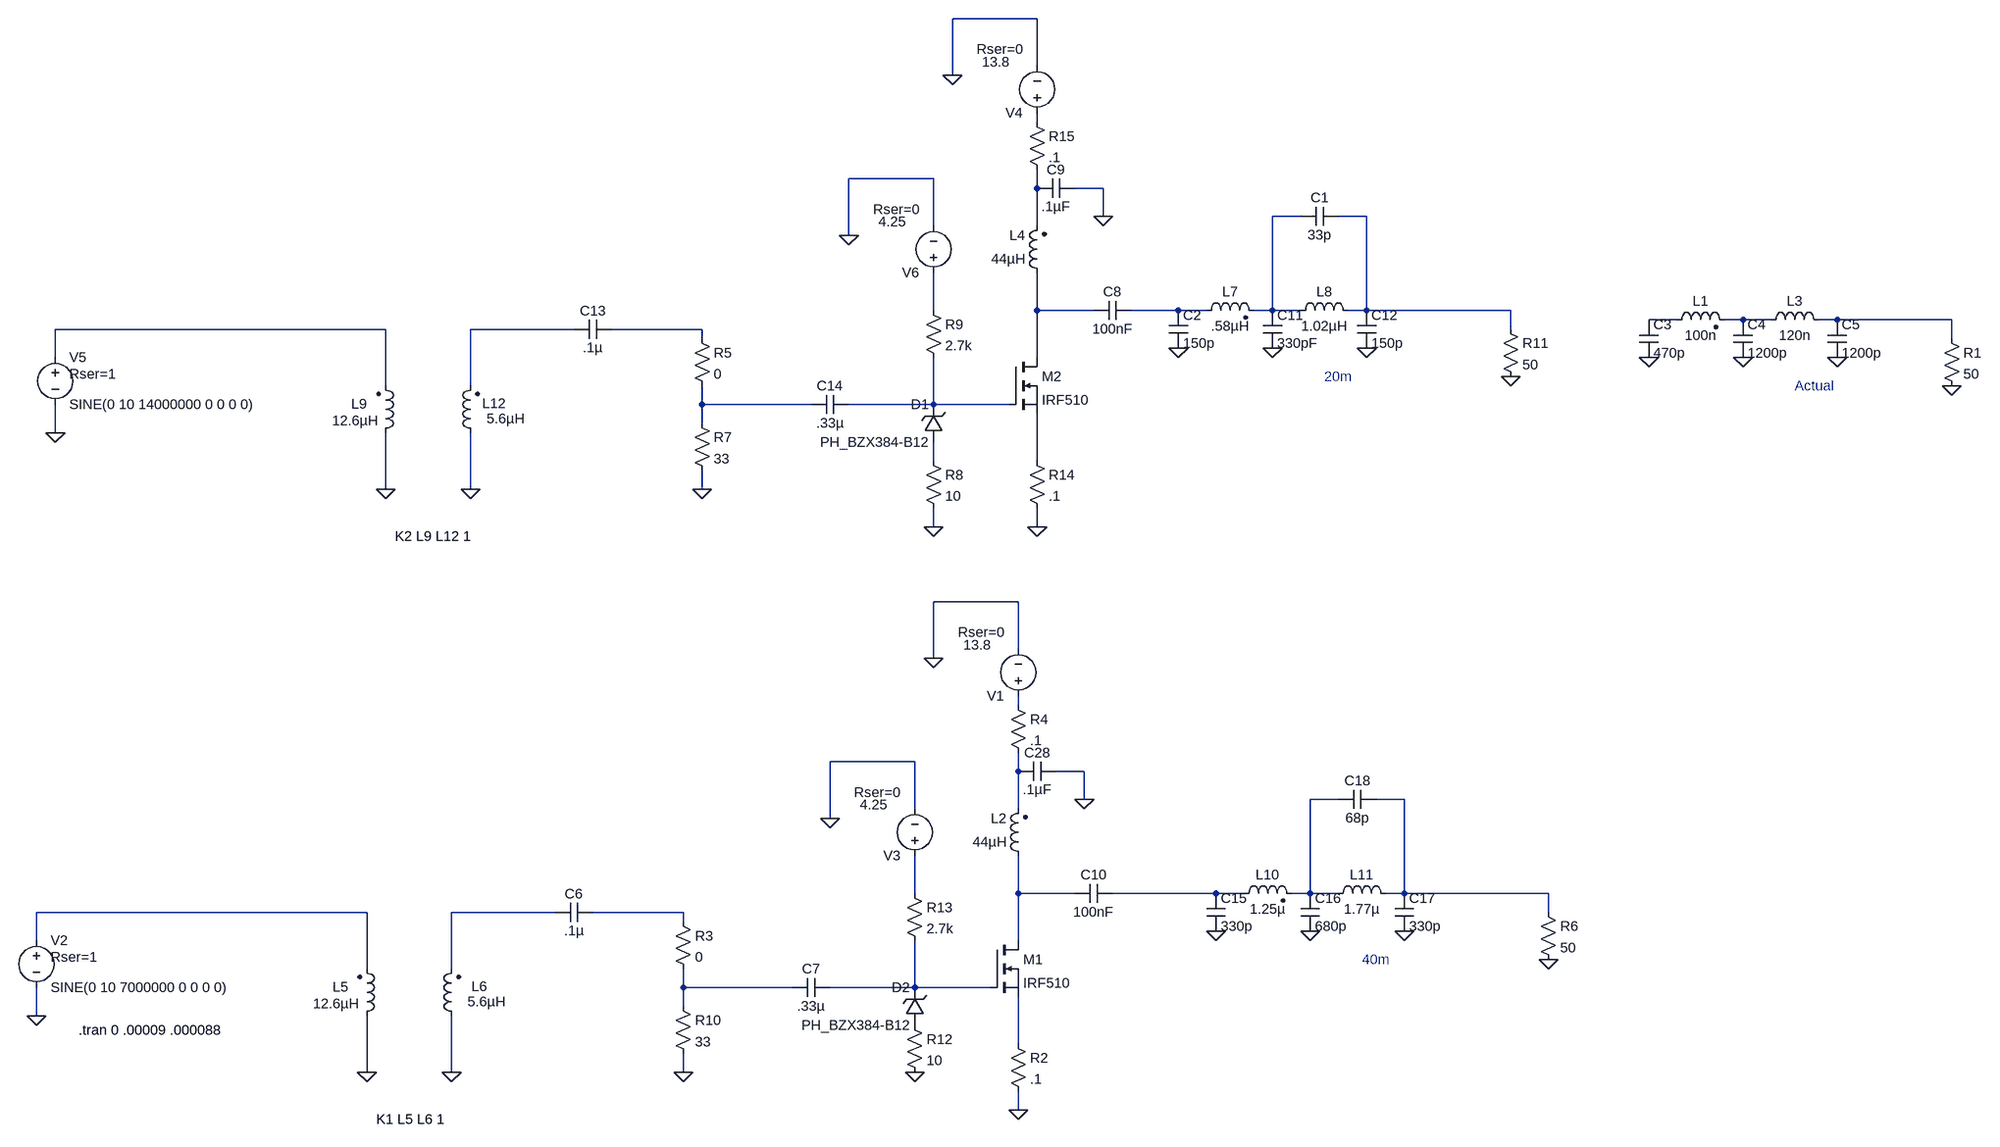
[diagram p0: schematic 10W IRF510 Amp.asc]
10W IRF510 Amp.asc, the LTspice schematic file:
Version 4
SHEET 1 3764 1240
WIRE 240 -1904 96 -1904
WIRE 240 -1824 240 -1904
WIRE 96 -1808 96 -1904
WIRE 240 -1728 240 -1744
WIRE 64 -1632 -80 -1632
WIRE 240 -1616 240 -1648
WIRE 352 -1616 304 -1616
WIRE 352 -1568 352 -1616
WIRE 688 -1568 640 -1568
WIRE 800 -1568 752 -1568
WIRE 64 -1552 64 -1632
WIRE 240 -1552 240 -1616
WIRE -80 -1536 -80 -1632
WIRE 64 -1408 64 -1472
WIRE 240 -1408 240 -1472
WIRE 336 -1408 240 -1408
WIRE 480 -1408 400 -1408
WIRE 528 -1408 480 -1408
WIRE 640 -1408 640 -1568
WIRE 640 -1408 608 -1408
WIRE 688 -1408 640 -1408
WIRE 800 -1408 800 -1568
WIRE 800 -1408 768 -1408
WIRE 1168 -1408 800 -1408
WIRE 1584 -1392 1536 -1392
WIRE 1696 -1392 1664 -1392
WIRE 1744 -1392 1696 -1392
WIRE 1856 -1392 1824 -1392
WIRE 2224 -1392 1856 -1392
WIRE -912 -1376 -1600 -1376
WIRE -592 -1376 -768 -1376
WIRE -336 -1376 -528 -1376
WIRE 1168 -1376 1168 -1408
WIRE -336 -1360 -336 -1376
WIRE 2224 -1360 2224 -1392
WIRE -1600 -1328 -1600 -1376
WIRE 240 -1328 240 -1408
WIRE -912 -1280 -912 -1376
WIRE -768 -1280 -768 -1376
WIRE -336 -1248 -336 -1280
WIRE -144 -1248 -336 -1248
WIRE 64 -1248 64 -1328
WIRE 64 -1248 -80 -1248
WIRE 192 -1248 64 -1248
WIRE -336 -1216 -336 -1248
WIRE -1600 -1200 -1600 -1248
WIRE 64 -1152 64 -1184
WIRE 240 -1152 240 -1232
WIRE -912 -1104 -912 -1200
WIRE -768 -1104 -768 -1200
WIRE -336 -1104 -336 -1136
WIRE 64 -1040 64 -1072
WIRE 240 -1040 240 -1072
WIRE 208 -704 64 -704
WIRE 208 -624 208 -704
WIRE 64 -608 64 -704
WIRE 208 -528 208 -544
WIRE 32 -432 -112 -432
WIRE 208 -416 208 -448
WIRE 320 -416 272 -416
WIRE 320 -368 320 -416
WIRE 752 -368 704 -368
WIRE 864 -368 816 -368
WIRE 32 -352 32 -432
WIRE 208 -352 208 -416
WIRE -112 -336 -112 -432
WIRE 32 -208 32 -272
WIRE 208 -208 208 -272
WIRE 304 -208 208 -208
WIRE 544 -208 368 -208
WIRE 592 -208 544 -208
WIRE 704 -208 704 -368
WIRE 704 -208 672 -208
WIRE 752 -208 704 -208
WIRE 864 -208 864 -368
WIRE 864 -208 832 -208
WIRE 1232 -208 864 -208
WIRE -944 -176 -1632 -176
WIRE -624 -176 -800 -176
WIRE -368 -176 -560 -176
WIRE 1232 -176 1232 -208
WIRE -368 -160 -368 -176
WIRE -1632 -128 -1632 -176
WIRE 208 -128 208 -208
WIRE -944 -80 -944 -176
WIRE -800 -80 -800 -176
WIRE -368 -48 -368 -80
WIRE -176 -48 -368 -48
WIRE 32 -48 32 -128
WIRE 32 -48 -112 -48
WIRE 160 -48 32 -48
WIRE -368 -16 -368 -48
WIRE -1632 0 -1632 -48
WIRE 208 48 208 -32
WIRE -944 96 -944 0
WIRE -800 96 -800 0
WIRE -368 96 -368 64
WIRE 208 160 208 128
FLAG 64 -608 0
FLAG 1168 -1296 0
FLAG 480 -1344 0
FLAG 640 -1344 0
FLAG 800 -1344 0
FLAG -1632 0 0
FLAG 320 -368 0
FLAG -944 96 0
FLAG -800 96 0
FLAG -368 96 0
FLAG 32 96 0
FLAG 208 160 0
FLAG -112 -336 0
FLAG 2224 -1280 0
FLAG 1536 -1328 0
FLAG 1696 -1328 0
FLAG 1856 -1328 0
FLAG 1232 -96 0
FLAG 544 -144 0
FLAG 704 -144 0
FLAG 864 -144 0
FLAG 96 -1808 0
FLAG -1600 -1200 0
FLAG 352 -1568 0
FLAG -912 -1104 0
FLAG -768 -1104 0
FLAG -336 -1104 0
FLAG 64 -1040 0
FLAG 240 -1040 0
FLAG -80 -1536 0
SYMBOL voltage 208 -528 R180
WINDOW 123 0 0 Left 0
WINDOW 39 24 124 Left 2
WINDOW 3 46 103 Left 2
SYMATTR SpiceLine Rser=0
SYMATTR Value 13.8
SYMATTR InstName V1
SYMBOL ind2 224 -256 R180
WINDOW 0 36 80 Left 2
WINDOW 3 36 40 Left 2
SYMATTR InstName L2
SYMATTR Value 44µH
SYMATTR Type ind
SYMBOL cap 368 -224 R90
WINDOW 0 0 32 VBottom 2
WINDOW 3 32 32 VTop 2
SYMATTR InstName C10
SYMATTR Value 100nF
SYMBOL ind2 -960 16 M180
WINDOW 0 -42 65 Left 2
WINDOW 3 -75 37 Left 2
SYMATTR InstName L5
SYMATTR Value 12.6µH
SYMATTR Type ind
SYMBOL ind2 -784 16 R180
WINDOW 0 -45 66 Left 2
WINDOW 3 -76 40 Left 2
SYMATTR InstName L6
SYMATTR Value 5.6µH
SYMATTR Type ind
SYMBOL res 1152 -1392 R0
SYMATTR InstName R11
SYMATTR Value 50
SYMBOL cap 464 -1408 R0
SYMATTR InstName C2
SYMATTR Value 150p
SYMBOL cap 624 -1408 R0
SYMATTR InstName C11
SYMATTR Value 330pF
SYMBOL cap 784 -1408 R0
SYMATTR InstName C12
SYMATTR Value 150p
SYMBOL ind2 512 -1392 R270
WINDOW 0 32 56 VTop 2
WINDOW 3 5 56 VBottom 2
SYMATTR InstName L7
SYMATTR Value .58µH
SYMATTR Type ind
SYMBOL ind 672 -1392 R270
WINDOW 0 32 56 VTop 2
WINDOW 3 5 56 VBottom 2
SYMATTR InstName L8
SYMATTR Value 1.02µH
SYMBOL voltage -1632 -144 R0
WINDOW 123 0 0 Left 0
WINDOW 39 24 44 Left 2
SYMATTR SpiceLine Rser=1
SYMATTR InstName V2
SYMATTR Value SINE(0 10 7000000 0 0 0 0)
SYMBOL cap 272 -432 R90
WINDOW 0 0 32 VBottom 2
WINDOW 3 32 32 VTop 2
SYMATTR InstName C28
SYMATTR Value .1µF
SYMBOL cap -560 -192 R90
WINDOW 0 0 32 VBottom 2
WINDOW 3 32 32 VTop 2
SYMATTR InstName C6
SYMATTR Value .1µ
SYMBOL zener 48 16 R180
WINDOW 0 24 64 Left 2
WINDOW 3 24 0 Left 2
SYMATTR InstName D2
SYMATTR Value PH_BZX384-B12
SYMBOL res -384 -176 R0
SYMATTR InstName R3
SYMATTR Value 0
SYMBOL res -384 -32 R0
SYMATTR InstName R10
SYMATTR Value 33
SYMBOL cap -112 -64 R90
WINDOW 0 0 32 VBottom 2
WINDOW 3 32 32 VTop 2
SYMATTR InstName C7
SYMATTR Value .33µ
SYMBOL res 16 0 R0
SYMATTR InstName R12
SYMATTR Value 10
SYMBOL nmos 160 -128 R0
SYMATTR InstName M1
SYMATTR Value IRF510
SYMBOL res 16 -224 R0
SYMATTR InstName R13
SYMATTR Value 2.7k
SYMBOL voltage 32 -256 R180
WINDOW 123 0 0 Left 0
WINDOW 39 24 124 Left 2
WINDOW 3 46 103 Left 2
SYMATTR SpiceLine Rser=0
SYMATTR Value 4.25
SYMATTR InstName V3
SYMBOL cap 752 -1584 R90
WINDOW 0 0 32 VBottom 2
WINDOW 3 32 32 VTop 2
SYMATTR InstName C1
SYMATTR Value 33p
SYMBOL res 2208 -1376 R0
SYMATTR InstName R1
SYMATTR Value 50
SYMBOL cap 1520 -1392 R0
SYMATTR InstName C3
SYMATTR Value 470p
SYMBOL cap 1680 -1392 R0
SYMATTR InstName C4
SYMATTR Value 1200p
SYMBOL cap 1840 -1392 R0
SYMATTR InstName C5
SYMATTR Value 1200p
SYMBOL ind2 1568 -1376 R270
WINDOW 0 32 56 VTop 2
WINDOW 3 5 56 VBottom 2
SYMATTR InstName L1
SYMATTR Value 100n
SYMATTR Type ind
SYMBOL ind 1728 -1376 R270
WINDOW 0 32 56 VTop 2
WINDOW 3 5 56 VBottom 2
SYMATTR InstName L3
SYMATTR Value 120n
SYMBOL res 192 32 R0
SYMATTR InstName R2
SYMATTR Value .1
SYMBOL res 192 -544 R0
SYMATTR InstName R4
SYMATTR Value .1
SYMBOL res 1216 -192 R0
SYMATTR InstName R6
SYMATTR Value 50
SYMBOL cap 528 -208 R0
SYMATTR InstName C15
SYMATTR Value 330p
SYMBOL cap 688 -208 R0
SYMATTR InstName C16
SYMATTR Value 680p
SYMBOL cap 848 -208 R0
SYMATTR InstName C17
SYMATTR Value 330p
SYMBOL ind2 576 -192 R270
WINDOW 0 32 56 VTop 2
WINDOW 3 5 56 VBottom 2
SYMATTR InstName L10
SYMATTR Value 1.25µ
SYMATTR Type ind
SYMBOL ind 736 -192 R270
WINDOW 0 32 56 VTop 2
WINDOW 3 5 56 VBottom 2
SYMATTR InstName L11
SYMATTR Value 1.77µ
SYMBOL cap 816 -384 R90
WINDOW 0 0 32 VBottom 2
WINDOW 3 32 32 VTop 2
SYMATTR InstName C18
SYMATTR Value 68p
SYMBOL voltage 240 -1728 R180
WINDOW 123 0 0 Left 0
WINDOW 39 24 124 Left 2
WINDOW 3 46 103 Left 2
SYMATTR SpiceLine Rser=0
SYMATTR Value 13.8
SYMATTR InstName V4
SYMBOL ind2 256 -1456 R180
WINDOW 0 36 80 Left 2
WINDOW 3 36 40 Left 2
SYMATTR InstName L4
SYMATTR Value 44µH
SYMATTR Type ind
SYMBOL cap 400 -1424 R90
WINDOW 0 0 32 VBottom 2
WINDOW 3 32 32 VTop 2
SYMATTR InstName C8
SYMATTR Value 100nF
SYMBOL ind2 -928 -1184 M180
WINDOW 0 -42 65 Left 2
WINDOW 3 -75 37 Left 2
SYMATTR InstName L9
SYMATTR Value 12.6µH
SYMATTR Type ind
SYMBOL ind2 -752 -1184 R180
WINDOW 0 -45 66 Left 2
WINDOW 3 -76 40 Left 2
SYMATTR InstName L12
SYMATTR Value 5.6µH
SYMATTR Type ind
SYMBOL voltage -1600 -1344 R0
WINDOW 123 0 0 Left 0
WINDOW 39 24 44 Left 2
SYMATTR SpiceLine Rser=1
SYMATTR InstName V5
SYMATTR Value SINE(0 10 14000000 0 0 0 0)
SYMBOL cap 304 -1632 R90
WINDOW 0 0 32 VBottom 2
WINDOW 3 32 32 VTop 2
SYMATTR InstName C9
SYMATTR Value .1µF
SYMBOL cap -528 -1392 R90
WINDOW 0 0 32 VBottom 2
WINDOW 3 32 32 VTop 2
SYMATTR InstName C13
SYMATTR Value .1µ
SYMBOL zener 80 -1184 R180
WINDOW 0 24 64 Left 2
WINDOW 3 24 0 Left 2
SYMATTR InstName D1
SYMATTR Value PH_BZX384-B12
SYMBOL res -352 -1376 R0
SYMATTR InstName R5
SYMATTR Value 0
SYMBOL res -352 -1232 R0
SYMATTR InstName R7
SYMATTR Value 33
SYMBOL cap -80 -1264 R90
WINDOW 0 0 32 VBottom 2
WINDOW 3 32 32 VTop 2
SYMATTR InstName C14
SYMATTR Value .33µ
SYMBOL res 48 -1168 R0
SYMATTR InstName R8
SYMATTR Value 10
SYMBOL nmos 192 -1328 R0
SYMATTR InstName M2
SYMATTR Value IRF510
SYMBOL res 48 -1424 R0
SYMATTR InstName R9
SYMATTR Value 2.7k
SYMBOL voltage 64 -1456 R180
WINDOW 123 0 0 Left 0
WINDOW 39 24 124 Left 2
WINDOW 3 46 103 Left 2
SYMATTR SpiceLine Rser=0
SYMATTR Value 4.25
SYMATTR InstName V6
SYMBOL res 224 -1168 R0
SYMATTR InstName R14
SYMATTR Value .1
SYMBOL res 224 -1744 R0
SYMATTR InstName R15
SYMATTR Value .1
TEXT -1560 24 Left 2 !.tran 0 .00009 .000088
TEXT -928 176 Left 2 !K1 L5 L6 1
TEXT 728 -1296 Left 2 ;20m
TEXT 1784 -1280 Left 2 ;Actual
TEXT 792 -96 Left 2 ;40m
TEXT -896 -1024 Left 2 !K2 L9 L12 1

The netlist it stands for:
* 10W IRF510 Amp.asc
V1 N018 0 13.8 Rser=0
L2 N023 N019 44µH
C10 N024 N023 100nF
L5 0 N025 12.6µH
L6 0 N026 5.6µH
R11 N004 0 50
C2 N007 0 150p
C11 N003 0 330pF
C12 N004 0 150p
L7 N007 N003 .58µH
L8 N003 N004 1.02µH
V2 N025 0 SINE(0 10 7000000 0 0 0 0) Rser=1
C28 0 N019 .1µF
C6 N027 N026 .1µ
D2 P001 N029 PH_BZX384-B12
R3 N027 N028 0
R10 N028 0 33
C7 N029 N028 .33µ
R12 P001 0 10
M1 N023 N029 N030 N030 IRF510
R13 N022 N029 2.7k
V3 N022 0 4.25 Rser=0
C1 N004 N003 33p
R1 N010 0 50
C3 N008 0 470p
C4 N009 0 1200p
C5 N010 0 1200p
L1 N008 N009 100n
L3 N009 N010 120n
R2 N030 0 .1
R4 N018 N019 .1
R6 N021 0 50
C15 N024 0 330p
C16 N020 0 680p
C17 N021 0 330p
L10 N024 N020 1.25µ
L11 N020 N021 1.77µ
C18 N021 N020 68p
V4 N001 0 13.8 Rser=0
L4 N006 N002 44µH
C8 N007 N006 100nF
L9 0 N011 12.6µH
L12 0 N012 5.6µH
V5 N011 0 SINE(0 10 14000000 0 0 0 0) Rser=1
C9 0 N002 .1µF
C13 N013 N012 .1µ
D1 N016 N015 PH_BZX384-B12
R5 N013 N014 0
R7 N014 0 33
C14 N015 N014 .33µ
R8 N016 0 10
M2 N006 N015 N017 N017 IRF510
R9 N005 N015 2.7k
V6 N005 0 4.25 Rser=0
R14 N017 0 .1
R15 N001 N002 .1
.model D D
.lib standard.dio
.model NMOS NMOS
.model PMOS PMOS
.lib standard.mos
.tran 0 .00009 .000088
K1 L5 L6 1
* 20m
* Actual
* 40m
K2 L9 L12 1
.backanno
.end